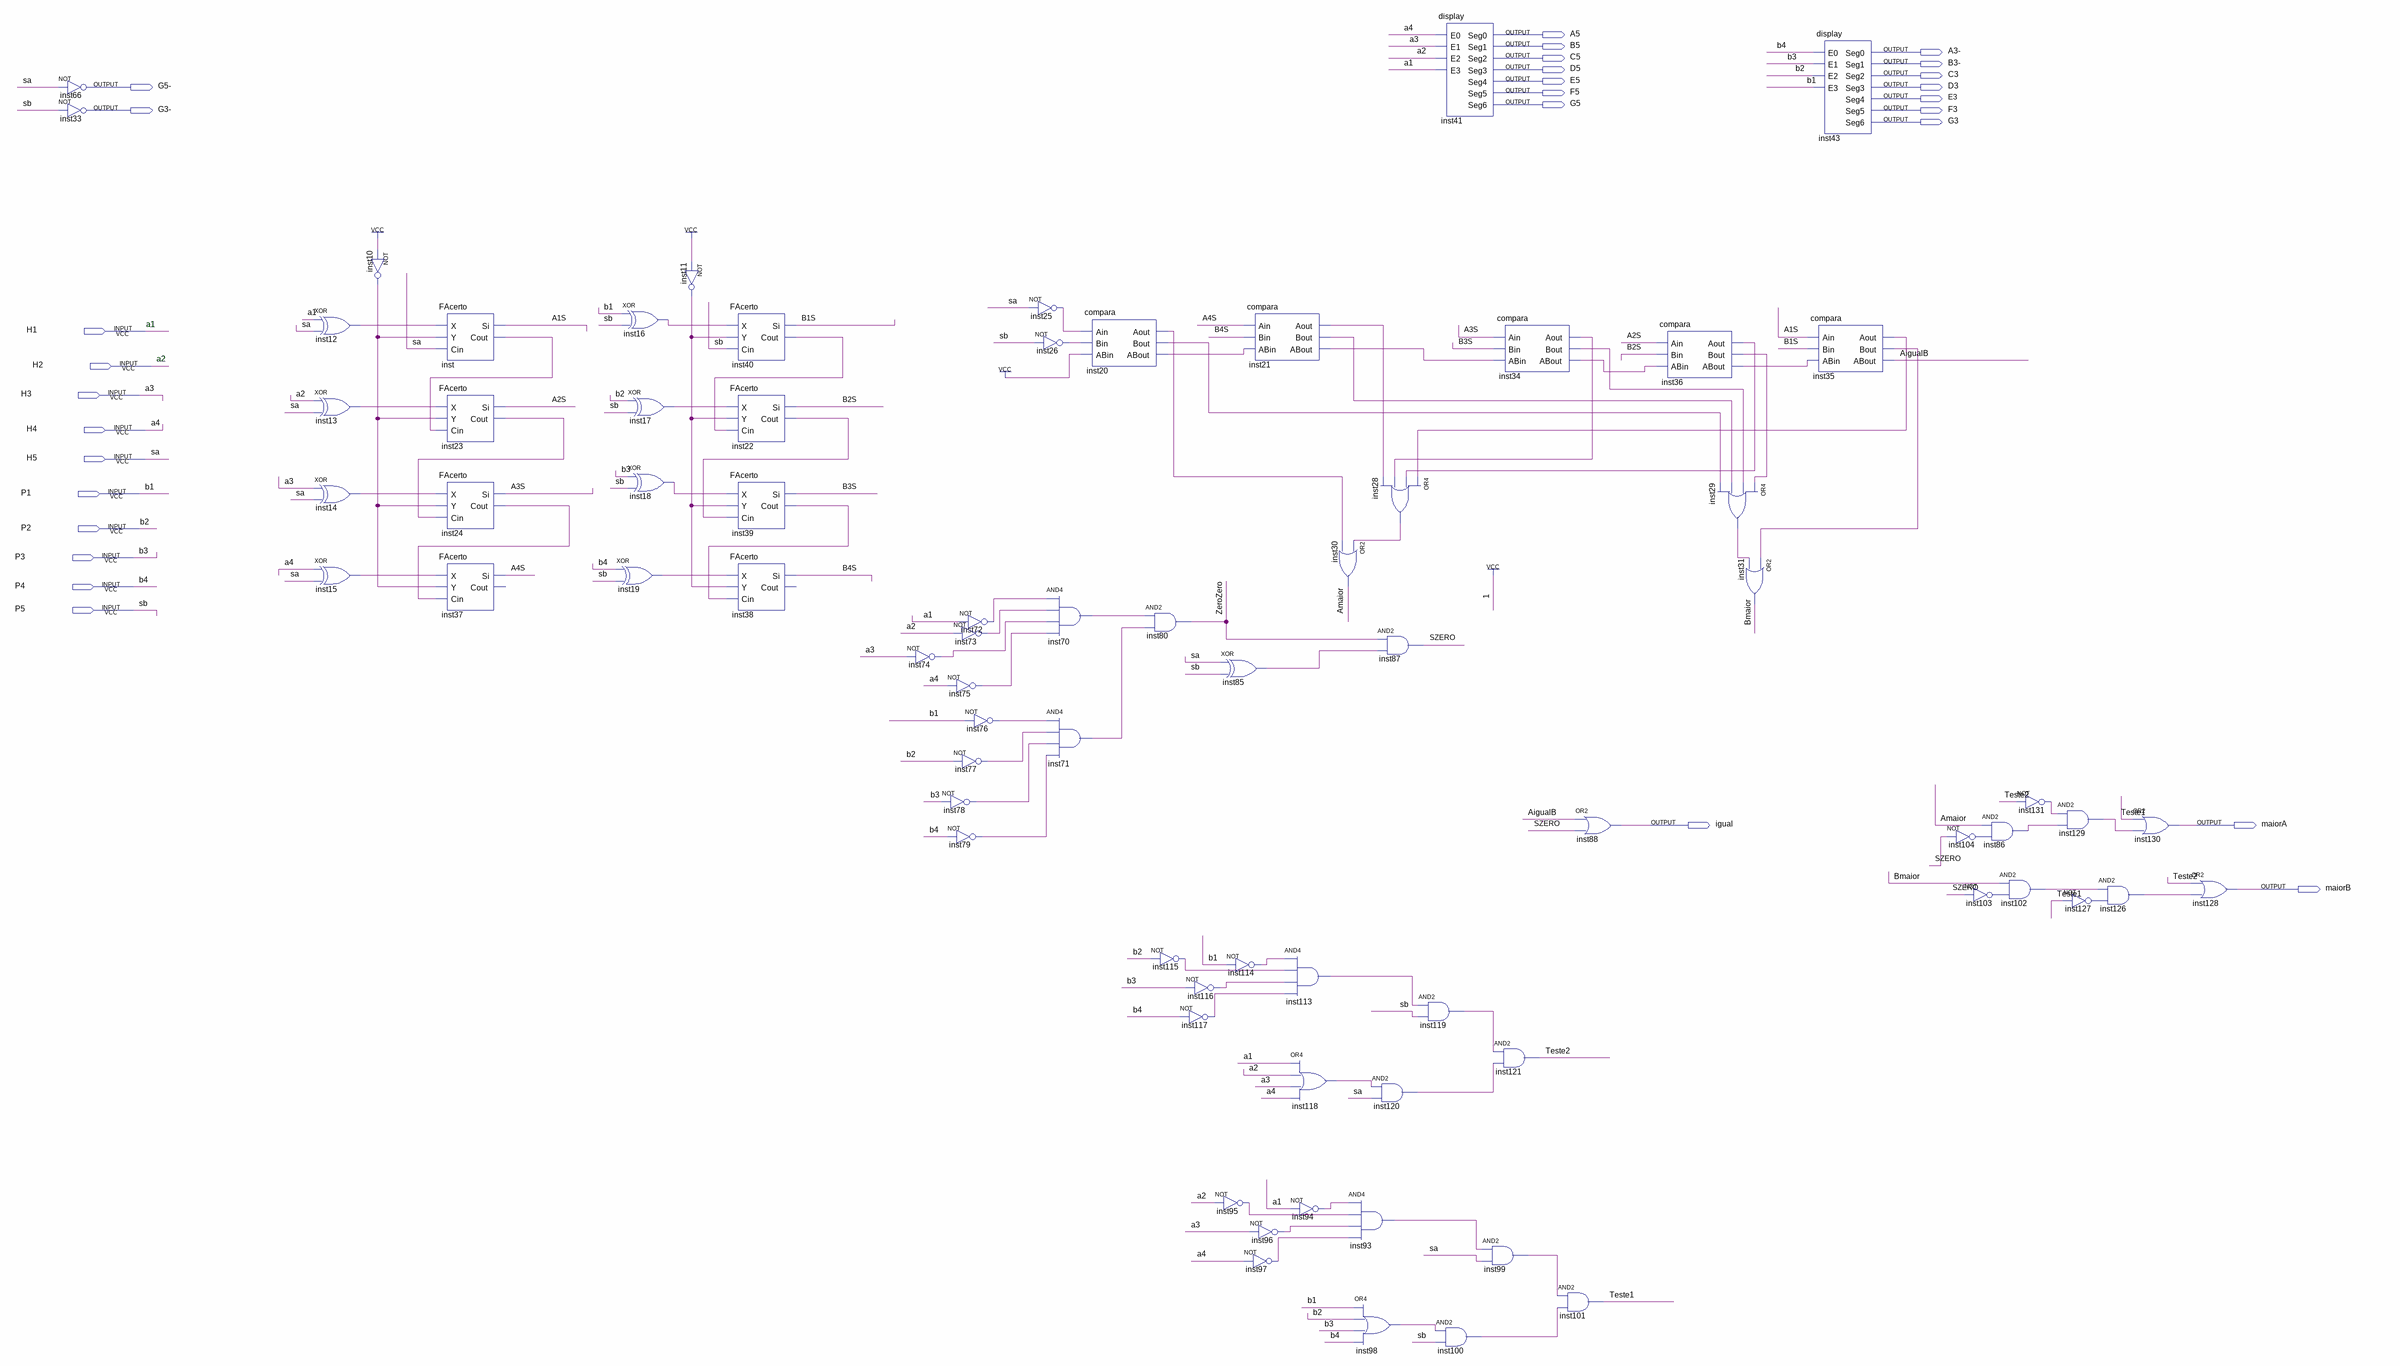
[diagram p0: schematic sheet]
// Quartus schematic aula13.bdf as structural Verilog: 75 symbols, 29 pins
module aula13 (
  input  H1,
  input  H2,
  input  H3,
  input  H4,
  input  H5,
  input  P1,
  input  P2,
  input  P3,
  input  P4,
  input  P5,
  output A5,
  output B5,
  output \A3- ,
  output C5,
  output \B3- ,
  output D5,
  output C3,
  output E5,
  output \G5- ,
  output D3,
  output F5,
  output E3,
  output G5,
  output \G3- ,
  output F3,
  output G3,
  output igual,
  output maiorA,
  output maiorB
);

  wire A1S, A2S, A3S, A4S, AigualB, Amaior, B1S, B2S, B3S, B4S, Bmaior, inst10_out, inst11_out, inst12_out,
       inst13_out, inst14_out, inst15_out, inst16_out, inst17_out, inst18_out, inst19_out, inst20_about,
       inst20_aout, inst20_bout, inst21_about, inst21_aout, inst21_bout, inst22_cout, inst23_cout,
       inst24_cout, inst25_out, inst26_out, inst28_out, inst29_out, inst34_about, inst34_aout, inst34_bout,
       inst35_aout, inst35_bout, inst36_about, inst36_aout, inst36_bout, inst39_cout, inst40_cout,
       inst70_out, inst71_out, inst72_out, inst73_out, inst74_out, inst75_out, inst76_out, inst77_out,
       inst78_out, inst79_out, inst85_out, inst86_out, inst93_out, inst94_out, inst95_out, inst96_out,
       inst97_out, inst98_out, inst99_out, inst100_out, inst102_out, inst103_out, inst104_out, inst113_out,
       inst114_out, inst115_out, inst116_out, inst117_out, inst118_out, inst119_out, inst120_out,
       inst126_out, inst127_out, inst129_out, inst131_out, inst_cout, SZERO, Teste1, Teste2, ZeroZero;

  not inst66 (\G5- , H5);
  not inst33 (\G3- , P5);
  xor inst12 (inst12_out, H1, H5);
  xor inst13 (inst13_out, H2, H5);
  xor inst14 (inst14_out, H3, H5);
  xor inst15 (inst15_out, H4, H5);
  not inst10 (inst10_out, 1'b1);
  FAcerto inst (.X(inst12_out), .Y(inst10_out), .Cin(H5), .Si(A1S), .Cout(inst_cout));
  FAcerto inst23 (.X(inst13_out), .Y(inst10_out), .Cin(inst_cout), .Si(A2S), .Cout(inst23_cout));
  FAcerto inst24 (.X(inst14_out), .Y(inst10_out), .Cin(inst23_cout), .Si(A3S), .Cout(inst24_cout));
  FAcerto inst37 (.X(inst15_out), .Y(inst10_out), .Cin(inst24_cout), .Si(A4S));  // open: Cout
  xor inst19 (inst19_out, P4, P5);
  xor inst16 (inst16_out, P1, P5);
  xor inst17 (inst17_out, P2, P5);
  xor inst18 (inst18_out, P3, P5);
  not inst11 (inst11_out, 1'b1);
  FAcerto inst40 (.X(inst16_out), .Y(inst11_out), .Cin(P5), .Si(B1S), .Cout(inst40_cout));
  FAcerto inst22 (.X(inst17_out), .Y(inst11_out), .Cin(inst40_cout), .Si(B2S), .Cout(inst22_cout));
  FAcerto inst39 (.X(inst18_out), .Y(inst11_out), .Cin(inst22_cout), .Si(B3S), .Cout(inst39_cout));
  FAcerto inst38 (.X(inst19_out), .Y(inst11_out), .Cin(inst39_cout), .Si(B4S));  // open: Cout
  not inst74 (inst74_out, H3);
  not inst78 (inst78_out, P3);
  not inst72 (inst72_out, H1);
  not inst73 (inst73_out, H2);
  not inst75 (inst75_out, H4);
  not inst76 (inst76_out, P1);
  not inst77 (inst77_out, P2);
  not inst79 (inst79_out, P4);
  not inst25 (inst25_out, H5);
  not inst26 (inst26_out, P5);
  compara inst20 (
    .Ain(inst25_out), .Bin(inst26_out), .ABin(1'b1), .Aout(inst20_aout), .Bout(inst20_bout),
    .ABout(inst20_about));
  and inst70 (inst70_out, inst72_out, inst73_out, inst74_out, inst75_out);
  and inst71 (inst71_out, inst76_out, inst77_out, inst78_out, inst79_out);
  and inst80 (ZeroZero, inst70_out, inst71_out);
  not inst115 (inst115_out, P2);
  xor inst85 (inst85_out, H5, P5);
  not inst116 (inst116_out, P3);
  not inst117 (inst117_out, P4);
  not inst95 (inst95_out, H2);
  compara inst21 (
    .Ain(A4S), .Bin(B4S), .ABin(inst20_about), .Aout(inst21_aout), .Bout(inst21_bout), .ABout(inst21_about));
  not inst114 (inst114_out, P1);
  not inst96 (inst96_out, H3);
  not inst97 (inst97_out, H4);
  and inst113 (inst113_out, inst114_out, inst115_out, inst116_out, inst117_out);
  or inst118 (inst118_out, H1, H2, H3, H4);
  not inst94 (inst94_out, H1);
  or inst30 (Amaior, inst28_out, inst20_aout);
  and inst93 (inst93_out, inst94_out, inst95_out, inst96_out, inst97_out);
  or inst98 (inst98_out, P1, P2, P3, P4);
  or inst28 (inst28_out, inst35_aout, inst36_aout, inst34_aout, inst21_aout);
  and inst87 (SZERO, ZeroZero, inst85_out);
  and inst120 (inst120_out, inst118_out, H5);
  display inst41 (
    .E0(H4), .E1(H3), .E2(H2), .E3(H1), .Seg0(A5), .Seg1(B5), .Seg2(C5), .Seg3(D5), .Seg4(E5), .Seg5(F5),
    .Seg6(G5));
  and inst119 (inst119_out, inst113_out, P5);
  and inst100 (inst100_out, inst98_out, P5);
  compara inst34 (
    .Ain(A3S), .Bin(B3S), .ABin(inst21_about), .Aout(inst34_aout), .Bout(inst34_bout), .ABout(inst34_about));
  and inst121 (Teste2, inst119_out, inst120_out);
  and inst99 (inst99_out, inst93_out, H5);
  or inst88 (igual, AigualB, SZERO);
  and inst101 (Teste1, inst99_out, inst100_out);
  compara inst36 (
    .Ain(A2S), .Bin(B2S), .ABin(inst34_about), .Aout(inst36_aout), .Bout(inst36_bout), .ABout(inst36_about));
  or inst29 (inst29_out, inst36_bout, inst34_bout, inst21_bout, inst20_bout);
  or inst31 (Bmaior, inst35_bout, inst29_out);
  display inst43 (
    .E0(P4), .E1(P3), .E2(P2), .E3(P1), .Seg0(\A3- ), .Seg1(\B3- ), .Seg2(C3), .Seg3(D3), .Seg4(E3),
    .Seg5(F3), .Seg6(G3));
  compara inst35 (.Ain(A1S), .Bin(B1S), .ABin(inst36_about), .Aout(inst35_aout), .Bout(inst35_bout), .ABout(AigualB));
  not inst104 (inst104_out, SZERO);
  not inst103 (inst103_out, SZERO);
  and inst86 (inst86_out, Amaior, inst104_out);
  and inst102 (inst102_out, Bmaior, inst103_out);
  not inst131 (inst131_out, Teste2);
  and inst129 (inst129_out, inst131_out, inst86_out);
  and inst126 (inst126_out, inst102_out, inst127_out);
  not inst127 (inst127_out, Teste1);
  or inst130 (maiorA, Teste1, inst129_out);
  or inst128 (maiorB, Teste2, inst126_out);

  // Other names for the same wires on the sheet: a1 = H1; a2 = H2; a3 = H3; a4 = H4; b1 = P1; b2 = P2; b3 = P3;
  //   b4 = P4; sa = H5; sb = P5

  // Notes on the sheet:
  //   a1
  //   a2
endmodule
